# Altium schematic sheet Top Overview.SchDoc: Top Overview
size A3; Author: Silard Gal; SheetNumber: 2; SheetTotal: 7
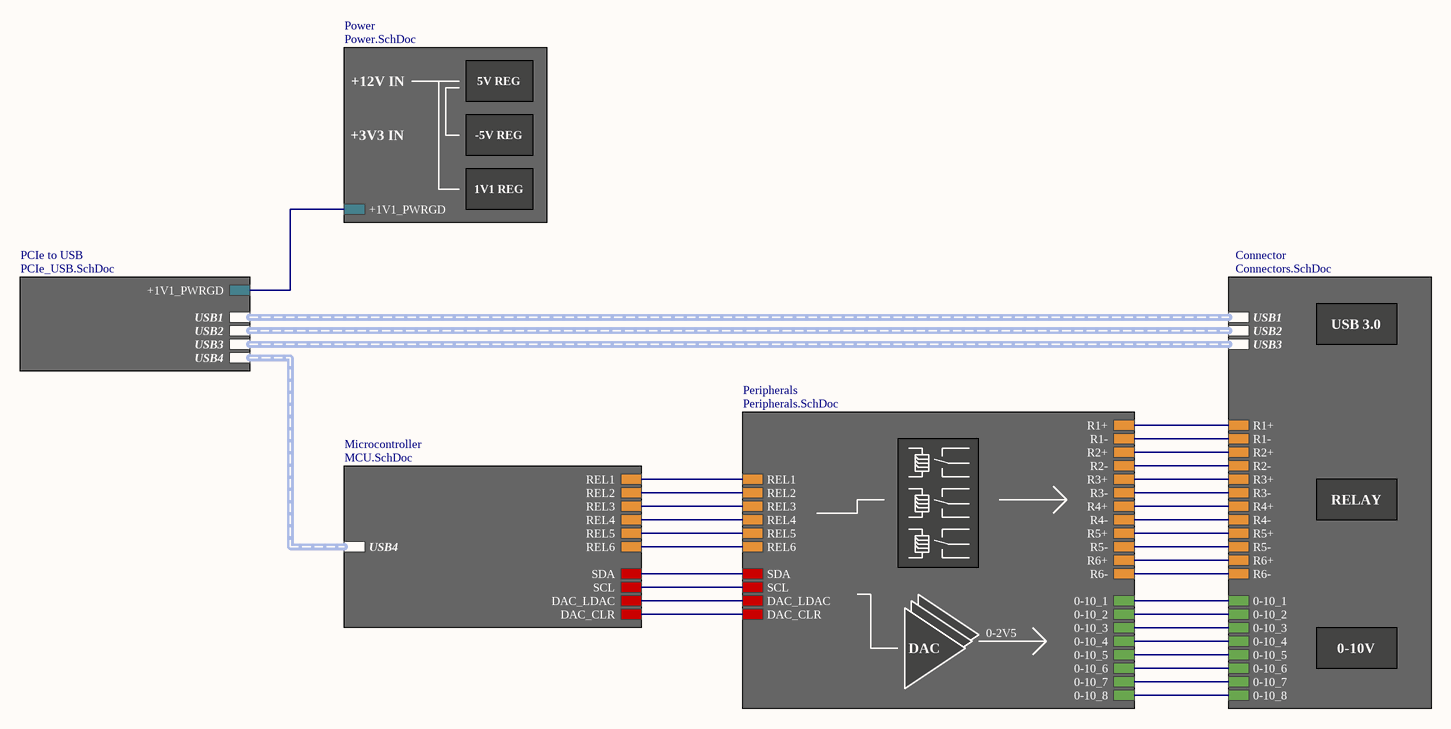
[diagram p0: Top Overview.SchDoc]

## Sub-sheets
Connector = Connectors.SchDoc: 0-10_2, 0-10_8, R4+, R2+, R4-, R1-, R3-, USB1 (harness USB_1), 0-10_6, USB3 (harness USB_3), 0-10_4, R6+, R2-, 0-10_7, R5+, R3+, R1+, 0-10_5, USB2 (harness USB_2), R5-, R6-, 0-10_3, 0-10_1
Microcontroller = MCU.SchDoc: SCL, REL5, REL4, DAC_LDAC, REL2, DAC_CLR, REL6, REL3, REL1, SDA, USB4 (harness USB_4)
PCIe to USB = PCIe_USB.SchDoc: USB4 (harness USB_4), USB2 (harness USB_2), USB3 (harness USB_3), USB1 (harness USB_1), +1V1_PWRGD
Peripherals = Peripherals.SchDoc: REL4, REL2, DAC_CLR, REL1, 0-10_6, REL6, REL3, R2+, 0-10_3, 0-10_2, 0-10_8, 0-10_4, R1+, 0-10_5, DAC_LDAC, SDA, R2-, SCL, 0-10_7, REL5, R1-, 0-10_1, R3-, R3+, R6+, R5-, R4+, R6-, R5+, R4-
Power = Power.SchDoc: +1V1_PWRGD

## Nets
(unnamed): sheet Connector/0-10_2, sheet Peripherals/0-10_2
(unnamed): sheet Connector/0-10_8, sheet Peripherals/0-10_8
(unnamed): sheet Connector/R4+, sheet Peripherals/R4+
(unnamed): sheet Connector/R2+, sheet Peripherals/R2+
(unnamed): sheet Connector/R4-, sheet Peripherals/R4-
(unnamed): sheet Connector/R1-, sheet Peripherals/R1-
(unnamed): sheet Connector/R3-, sheet Peripherals/R3-
(unnamed): sheet Connector/0-10_6, sheet Peripherals/0-10_6
(unnamed): sheet Connector/0-10_4, sheet Peripherals/0-10_4
(unnamed): sheet Connector/R6+, sheet Peripherals/R6+
(unnamed): sheet Connector/R2-, sheet Peripherals/R2-
(unnamed): sheet Connector/0-10_7, sheet Peripherals/0-10_7
(unnamed): sheet Connector/R5+, sheet Peripherals/R5+
(unnamed): sheet Connector/R3+, sheet Peripherals/R3+
(unnamed): sheet Connector/R1+, sheet Peripherals/R1+
(unnamed): sheet Connector/0-10_5, sheet Peripherals/0-10_5
(unnamed): sheet Connector/R5-, sheet Peripherals/R5-
(unnamed): sheet Connector/R6-, sheet Peripherals/R6-
(unnamed): sheet Connector/0-10_3, sheet Peripherals/0-10_3
(unnamed): sheet Connector/0-10_1, sheet Peripherals/0-10_1
(unnamed): sheet Peripherals/REL4, sheet Microcontroller/REL4
(unnamed): sheet Peripherals/REL2, sheet Microcontroller/REL2
(unnamed): sheet Peripherals/DAC_CLR, sheet Microcontroller/DAC_CLR
(unnamed): sheet Peripherals/REL1, sheet Microcontroller/REL1
(unnamed): sheet Peripherals/REL6, sheet Microcontroller/REL6
(unnamed): sheet Peripherals/REL3, sheet Microcontroller/REL3
(unnamed): sheet Peripherals/DAC_LDAC, sheet Microcontroller/DAC_LDAC
(unnamed): sheet Peripherals/SDA, sheet Microcontroller/SDA
(unnamed): sheet Peripherals/SCL, sheet Microcontroller/SCL
(unnamed): sheet Peripherals/REL5, sheet Microcontroller/REL5
(unnamed): sheet PCIe to USB/+1V1_PWRGD, sheet Power/+1V1_PWRGD

## Buses and harness runs
harness sheet Connector/USB1 = sheet PCIe to USB/USB1
harness sheet Connector/USB2 = sheet PCIe to USB/USB2
harness sheet Connector/USB3 = sheet PCIe to USB/USB3
harness sheet Microcontroller/USB4 = sheet PCIe to USB/USB4

## Notes on the sheet
- +12V IN
- +3V3 IN
- -5V REG
- 5V REG
- 1V1 REG
- USB 3.0
- RELAY
- DAC
- 0-2V5
- 0-10V
- Title:
- Author:
- Size:
- Date:
- A3
- Prj:
- https://www.silardgal.com
- SW Version:
- Variant:
- Edited:
- File: